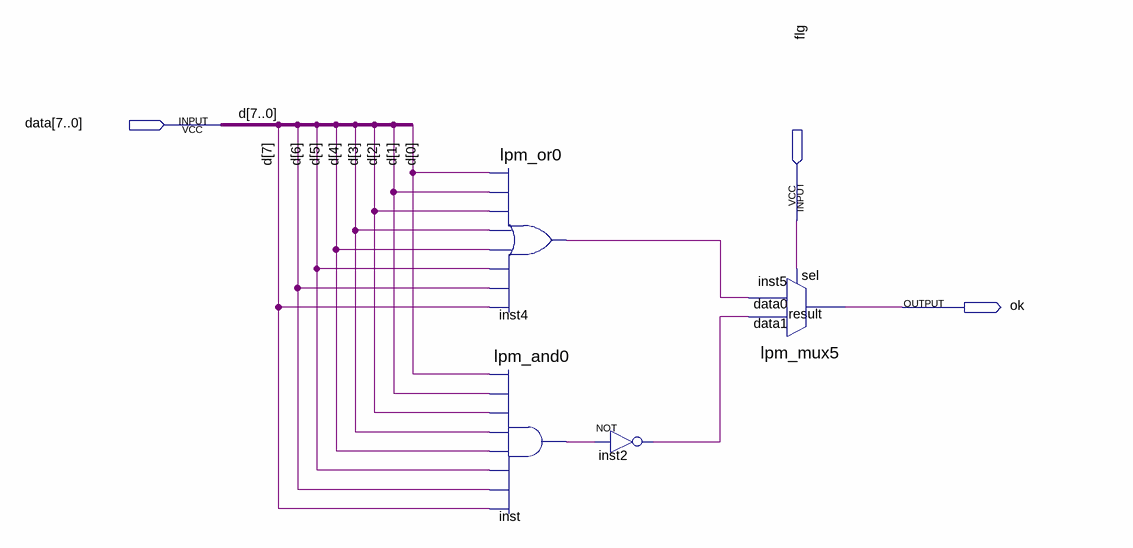
[diagram p0: schematic sheet]
// Quartus schematic isOk.bdf as structural Verilog: 4 symbols, 3 pins
module isOk (
  input  [7:0] data,
  input  flg,
  output ok
);

  wire inst2_out, inst4_result, inst_result;

  lpm_or0 inst4 (
    .data0(data[0]), .data1(data[1]), .data2(data[2]), .data3(data[3]), .data4(data[4]), .data5(data[5]),
    .data6(data[6]), .data7(data[7]), .result(inst4_result));
  lpm_and0 inst (
    .data0(data[0]), .data1(data[1]), .data2(data[2]), .data3(data[3]), .data4(data[4]), .data5(data[5]),
    .data6(data[6]), .data7(data[7]), .result(inst_result));
  not inst2 (inst2_out, inst_result);
  lpm_mux5 inst5 (.data1(inst2_out), .data0(inst4_result), .sel(flg), .result(ok));

  // Other names for the same wires on the sheet: d[7:0] = data
endmodule
